# EasyEDA schematic SCH_RiberyController_2024-03-02.json
TITLE: PCB_Controller; REV: 1.0; Date: 2023-09-17; Sheet: 1/1; Drawn By: Fran Gómez; Company: fr4231gm
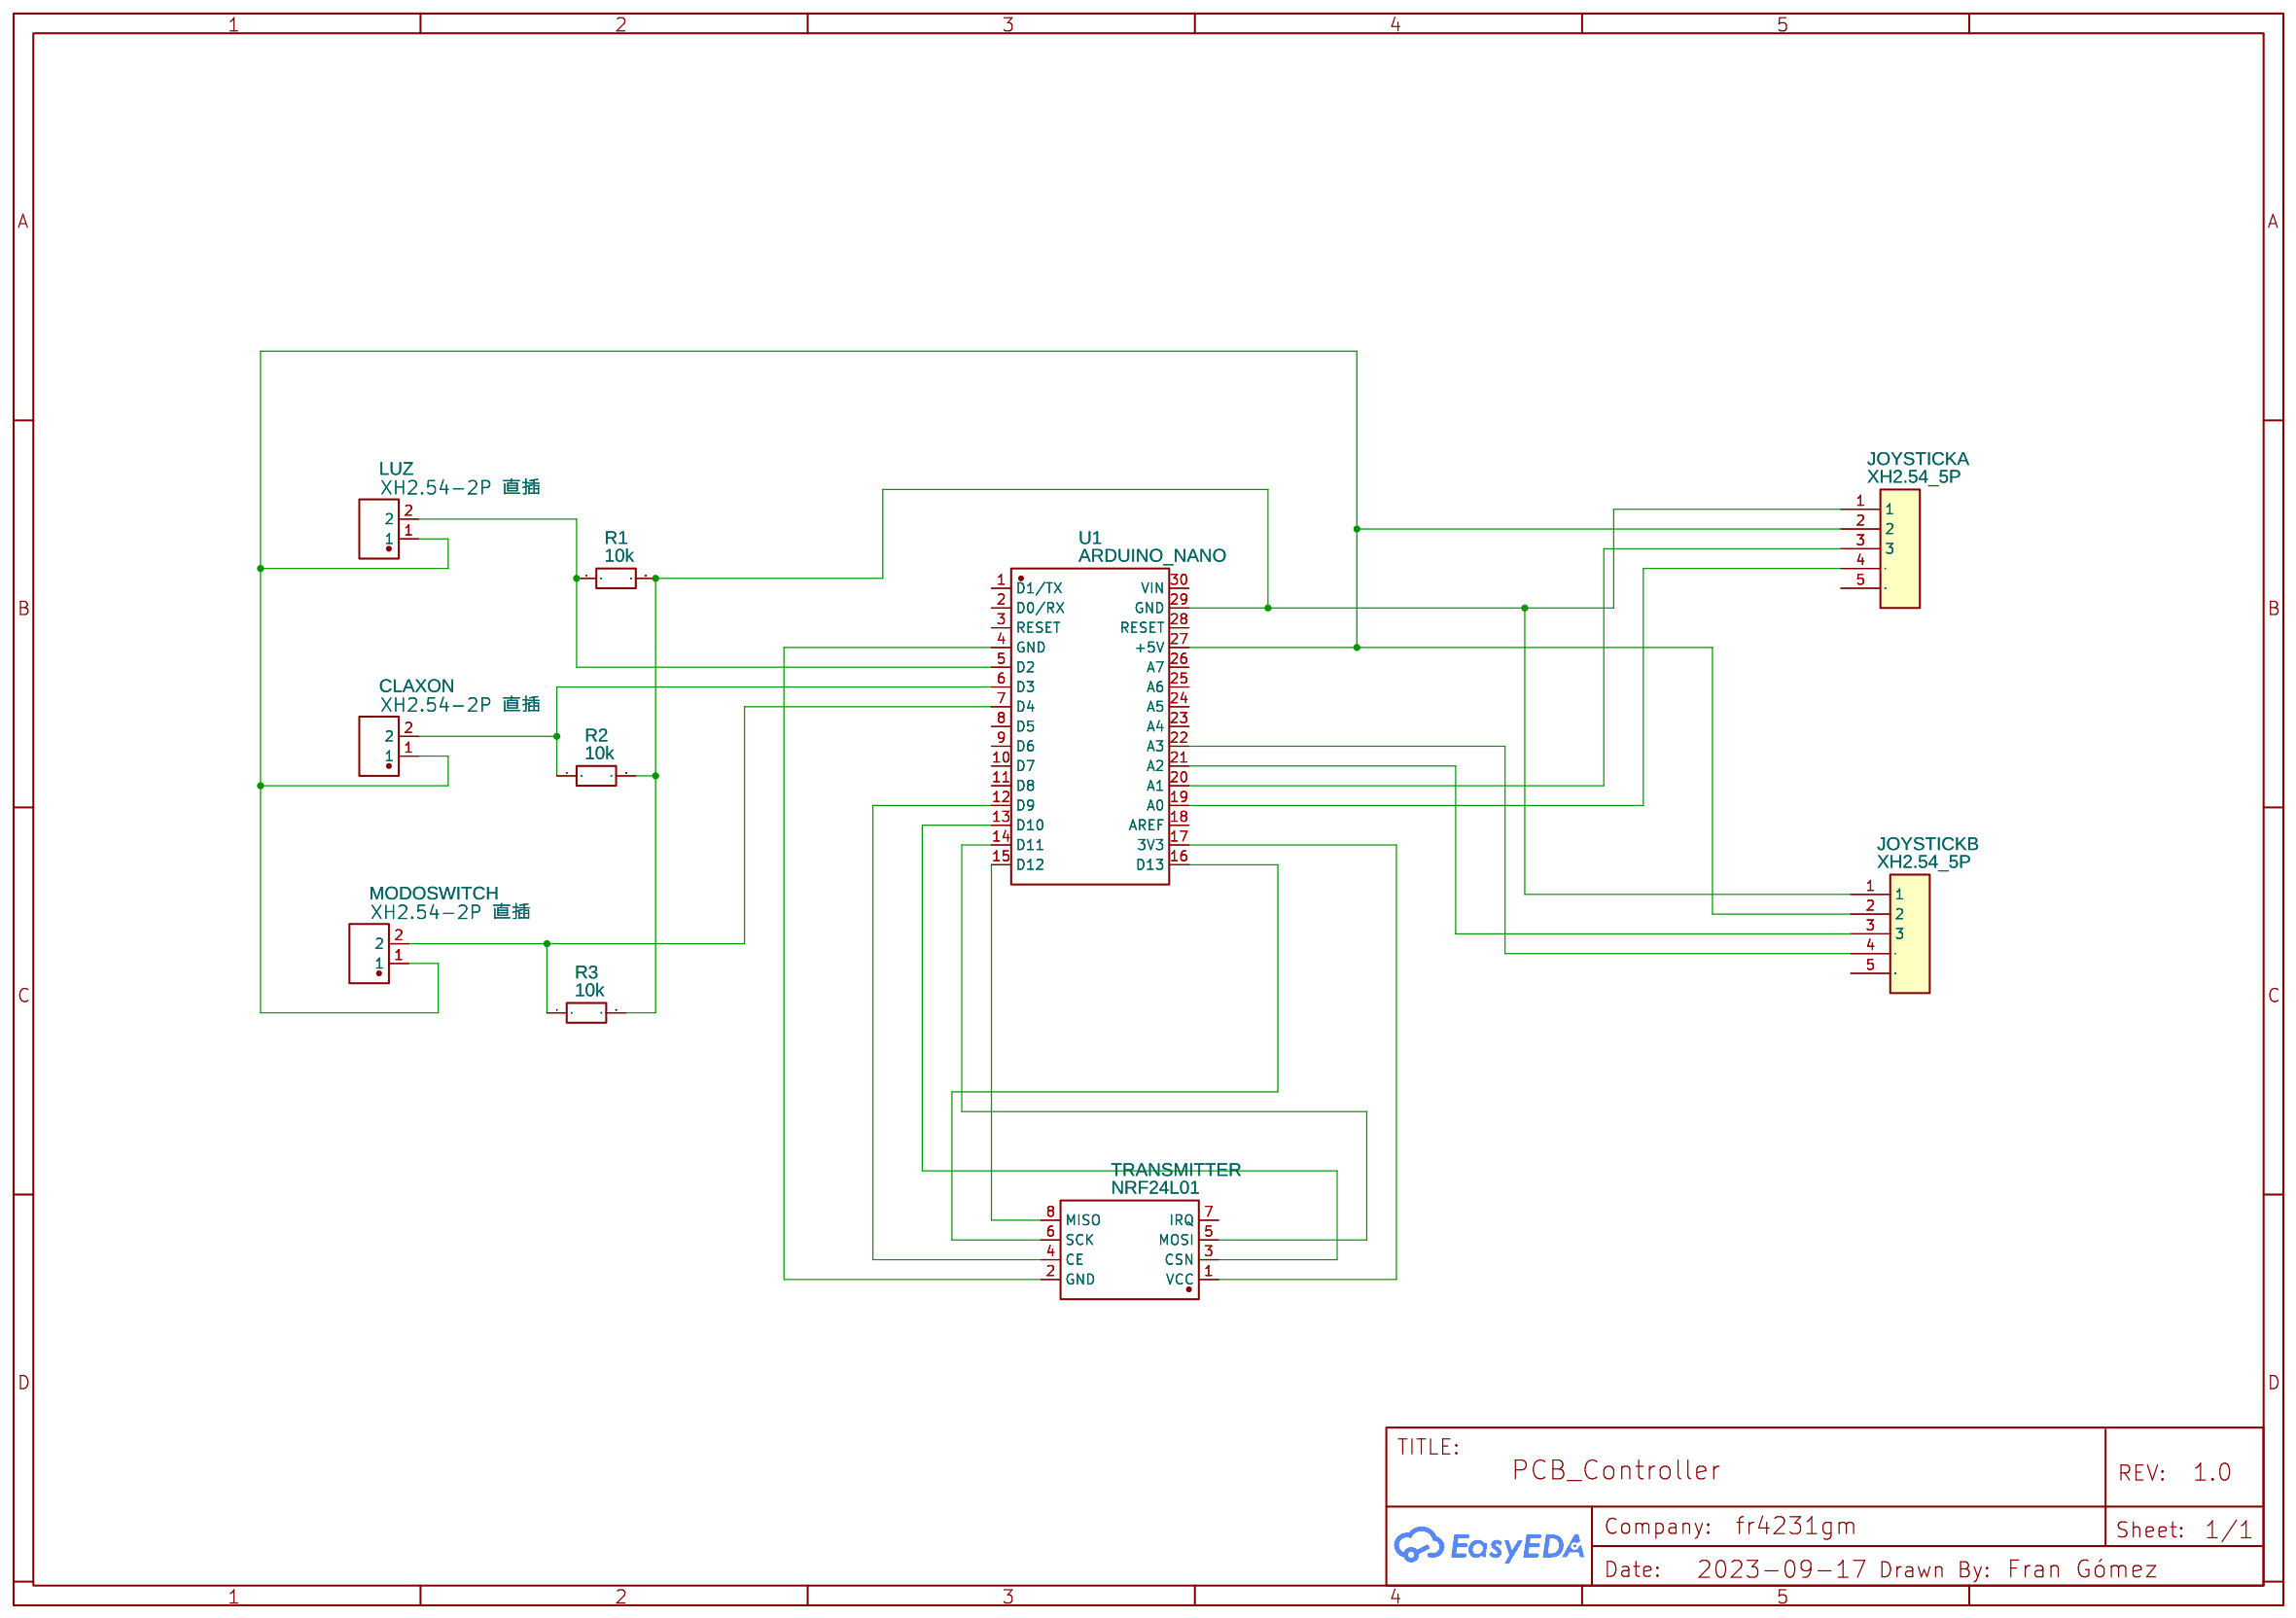
[diagram p0: schematic sheet]

## Parts
CLAXON  XH2.54-2P 直插  [CONN-TH_2P-P2.50-XH2.54-2P]
JOYSTICKA  XH2.54_5P  [XH2.54-5P]
JOYSTICKB  XH2.54_5P  [XH2.54-5P]
LUZ  XH2.54-2P 直插  [CONN-TH_2P-P2.50-XH2.54-2P]
MODOSWITCH  XH2.54-2P 直插  [CONN-TH_2P-P2.50-XH2.54-2P]
R1  10k  [R_AXIAL-0.3]
R2  10k  [R_AXIAL-0.3]
R3  10k  [R_AXIAL-0.3]
TRANSMITTER  NRF24L01  [WIRELM-SMD_NRF24L01]
U1  ARDUINO_NANO  [COMM-TH_ARDUINO_NANO]

## Library data of the parts
CLAXON LUZ MODOSWITCH = XH2.54-2P 直插: Contributor: LCSC; Supplier: LCSC; Supplier Part: C9900000097; Manufacturer: null; JLCPCB Part Class: Extended Part; link: https://lcsc.com/eda_search?q=C9900000097&%26type=1&ref=editor
JOYSTICKA JOYSTICKB = XH2.54_5P: Manufacturer Part: XH2.54_3P; Contributor: freddyka
R1-R3 = R_AXIAL-0.3_EU: Contributor: LCEDA_Lib
TRANSMITTER = NRF24L01: Supplier: LCSC; Manufacturer: Ai-Thinker(安信可); Manufacturer Part: NF-04; Supplier Part: C90751; JLCPCB Part Class: Extended Part; link: https://lcsc.com/eda_search?q=C90751&%26type=1&ref=editor
U1 = ARDUINO_NANO: Contributor: lcsc; Supplier: LCSC; Supplier Part: C9900017879; Manufacturer: null; JLCPCB Part Class: Extended Part; link: https://lcsc.com/eda_search?q=C9900017879&%26type=1&ref=editor

## Nets
Net-(CLAXON-1): CLAXON.1 JOYSTICKA.2 JOYSTICKB.2 LUZ.1 MODOSWITCH.1 U1.27(+5V)
Net-(CLAXON-2): CLAXON.2 R2.1 U1.6(D3)
Net-(JOYSTICKA-1): JOYSTICKA.1 JOYSTICKB.1 R1.2 R2.2 R3.2 U1.29(GND)
Net-(JOYSTICKA-3): JOYSTICKA.3 U1.20(A1)
Net-(JOYSTICKA-4): JOYSTICKA.4 U1.19(A0)
Net-(JOYSTICKB-3): JOYSTICKB.3 U1.21(A2)
Net-(JOYSTICKB-4): JOYSTICKB.4 U1.22(A3)
Net-(LUZ-2): LUZ.2 R1.1 U1.5(D2)
Net-(MODOSWITCH-2): MODOSWITCH.2 R3.1 U1.7(D4)
Net-(TRANSMITTER-1): TRANSMITTER.1(VCC) U1.17(3V3)
Net-(TRANSMITTER-2): TRANSMITTER.2(GND) U1.4(GND)
Net-(TRANSMITTER-3): TRANSMITTER.3(CSN) U1.13(D10)
Net-(TRANSMITTER-4): TRANSMITTER.4(CE) U1.12(D9)
Net-(TRANSMITTER-5): TRANSMITTER.5(MOSI) U1.14(D11)
Net-(TRANSMITTER-6): TRANSMITTER.6(SCK) U1.16(D13)
Net-(TRANSMITTER-8): TRANSMITTER.8(MISO) U1.15(D12)

Not connected (* = marked no-connect by the designer): JOYSTICKA 5; JOYSTICKB 5; TRANSMITTER 7(IRQ); U1 1(D1/TX) 2(D0/RX) 3(RESET) 8(D5) 9(D6) 10(D7) 11(D8) 18(AREF) 23(A4) 24(A5) 25(A6) 26(A7) 28(RESET) 30(VIN)
